# Altium schematic sheet PTFV_MECHANICAL.SchDoc: PTFV_MECHANICAL
size A4; DrawnBy: All; Revision: 1; SheetNumber: 4; SheetTotal: 4  of  5
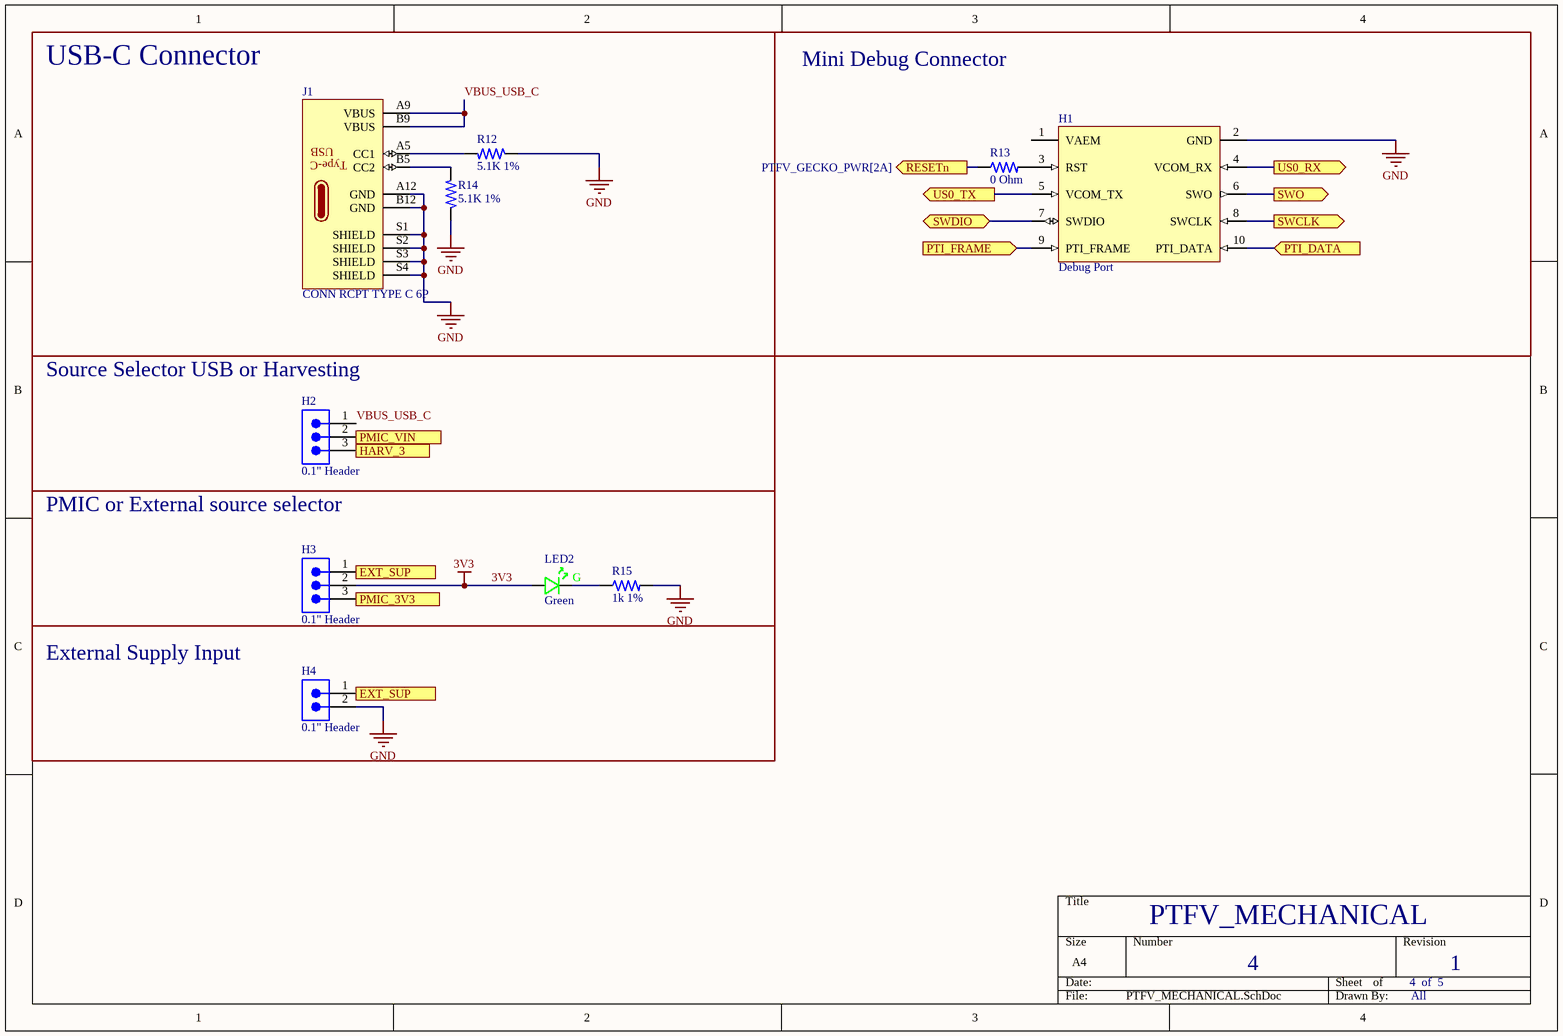
[diagram p0: PTFV_MECHANICAL.SchDoc]

## Parts
H1  Debug Port  [Amphenol_20021121_0]
H2  0.1" Header  [3-PIN_MALE_HEADER_01-IN]
H3  0.1" Header  [3-PIN_MALE_HEADER_01-IN]
H4  0.1" Header  [2-PIN_MALE_HEADER_01-IN]
J1  CONN RCPT TYPE C 6P  [USB4125-GF-A_REVA2]
LED2  Green  [LED_0603_GRN_WL-SMCW]
R12  5.1K 1%  [RES_0603_1608X06]
R13  0 Ohm  [RES_0603_1608X06]
R14  5.1K 1%  [RES_0603_1608X06]
R15  1k 1%  [RES_0603_1608X06]

## Blocks framed on the sheet
USB-C Connector: J1 R12 R14
Mini Debug Connector: H1 R13
Source Selector USB or Harvesting: H2
PMIC or External source selector: H3 LED2 R15
External Supply Input: H4

## Ports
EXT_SUP (in, see PTFV_MECHANICAL[1C]), EXT_SUP (out, see PTFV_MECHANICAL[1C]), HARV_3 (out, see PTFV_PWR_PMIC[1B]), PMIC_3V3 (in, see PTFV_PWR_PMIC[3B]), PMIC_VIN (out, see PTFV_PWR_PMIC[1B]), PTI_DATA (in, see PTFV_GECKO_SNSR[2A]), PTI_FRAME (in, see PTFV_GECKO_SNSR[2A]), RESETn (out, see PTFV_GECKO_PWR[2A]), SWCLK (out, see PTFV_GECKO_SNSR[2A]), SWDIO (bidir, see PTFV_GECKO_SNSR[2A]), SWO (out, see PTFV_GECKO_SNSR[2A]), US0_RX (out, see PTFV_GECKO_SNSR[2A]), US0_TX (out, see PTFV_GECKO_SNSR[2A])

## Nets
3V3: H3.2 LED2.A
GND: H1.2(GND) H4.2 J1.A12(GND) J1.B12(GND) J1.S1(SHIELD) J1.S2(SHIELD) J1.S3(SHIELD) J1.S4(SHIELD) R12.1 R14.1 R15.2
EXT_SUP: H3.1 H4.1 ; port EXT_SUP
HARV_3: H2.3 ; port HARV_3
PMIC_3V3: H3.3 ; port PMIC_3V3
PMIC_VIN: H2.2 ; port PMIC_VIN
PTI_DATA: H1.10(PTI_DATA) ; port PTI_DATA
PTI_FRAME: H1.9(PTI_FRAME) ; port PTI_FRAME
RESETn: R13.1 ; port RESETn
SWCLK: H1.8(SWCLK) ; port SWCLK
SWDIO: H1.7(SWDIO) ; port SWDIO
SWO: H1.6(SWO) ; port SWO
US0_RX: H1.4(VCOM_RX) ; port US0_RX
US0_TX: H1.5(VCOM_TX) ; port US0_TX
VBUS_USB_C: H2.1 J1.A9(VBUS) J1.B9(VBUS)
NetH1_3: H1.3(RST) R13.2
NetJ1_A5: J1.A5(CC1) R12.2
NetJ1_B5: J1.B5(CC2) R14.2
NetLED2_C: LED2.C R15.1

Not connected (* = marked no-connect by the designer): H1 1(VAEM)

## Notes on the sheet
- (in symbol 150060GS75000) G
- (in symbol USB_Type_C_6P_RA_TH) USB; Type-C

## Library data of the parts
H1 = 20021121-00010C1LF: CONN HEADER SMD 10POS 1.27MM. Connector Header Surface Mount 10 position 0.050"; Manufacturer: Amphenol ICC / FCI; Supplier 1: Digi-Key; Manufacturer Part Number: 20021121-00010C1LF; RoHS: No; Category: Headers and Wire Housings
H2 H3 = PRPC003SAAN-RC: CONN HEADER VERT 3POS 2.54MM; Manufacturer: Sullins; Connector Type: Header, Unshrouded, Breakaway; Number of Positions: 3; Number of Positions Loaded: All; Pitch: 0.100" (2.54mm); Online Catalog: 0.100" (2.54mm) Pitch Connector Headers; Other Names: S9510E-03  S9510E-03-ND; Supplier 1: Digi-Key; Manufacturer Part Number: PRPC003SAAN-RC; Stock 1: 19067; Pricing 1: 1=0.12, 10=0.109, 25=0.0812, 50=0.0696, 100=0.0673, 250=0.058, 500=0.0557 (USD); Standard Package: 1; Category: Connectors, Interconnects; Family: Rectangular Connectors - Headers, Male Pins; Series: -; Packaging: Bulk; Contact Type: Male Pin; Number of Rows: 1; Row Spacing: -; Contact Mating Length: 0.230" (5.84mm); Mounting Type: Through Hole; Termination: Solder; Fastening Type: -; Features: -; Contact Finish: Gold; Contact Finish Thickness: Flash; Color: Black; ComponentLink1URL: https://media.digikey.com/PDF/Data%20Sheets/Sullins%20PDFs/xRxCzzzSxxN-RC_ST_11635-B.pdf?src-supplier=Digi-Key; ComponentLink1Description: https://media.digikey.com/PDF/Data%20Sheets/Sullins%20PDFs/xRxCzzzSxxN-RC_ST_11635-B.pdf?src-supplier=Digi-Key; Supplier Part Number 1: S1011EC-03-ND
H4 = GRPB021VWVN-RC: Conn Unshrouded Header HDR 2 POS 2.54 MM Solder ST Top Entry Thru-Hole; Manufacturer: Sullins; Number of Positions: 2; Pitch: 1.27mm; Supplier: Digi-Key; Supplier Part Number: S9014E-02-ND; Manufacturer Part Number: GRPB021VWVN-RC; RoHS: Yes; Category: Headers and Wire Housings; Stock: 123797; Pricing: 1=0.25, 10=0.21, 100=0.1615, 500=0.13662, 1000=0.11178, 5000=0.09936, 10000=0.09005 (USD); Mounting Technology: Through Hole; Contact Material: Brass; Contact Shape: Square; Contact Finish - Mating: GOLD; Insulation Material: Nylon; Min Operating Temperature: -40°C; Max Operating Temperature: 105°C; Number of Rows: 1; Termination: Solder; Connector Type: Header; Contact Type: Male Pin; Fastening Type: Pull; Series: -; Packaging: Bulk; RoHS Compliant: Yes; Flammability Rating: UL94 V-0; Lead Free: Lead Free; ComponentLink1URL: https://datasheet.ciiva.com/726/71-grpb-1vwvn-rc-10957-c-726648.pdf?src-supplier=Digi-Key; ComponentLink1Description: https://datasheet.ciiva.com/726/71-grpb-1vwvn-rc-10957-c-726648.pdf?src-supplier=Digi-Key
J1 = USB_Type_C_6P_RA_TH: USB-C (USB TYPE-C) Receptacle Connector 24 (6+18 Dummy) Position Surface Mount, Right Angle; Through Hole; Manufacturer: GCT; Package: Cut-Tape; Manufacturer Part Number: USB4125-GF-A_REVA2; Price: None; Availability: Available; ComponentLink1Description: Digikey Link; ComponentLink1URL: https://www.digikey.com/en/products/detail/gct/USB4125-GF-A/13547388; Category: Connectors; Supplier: Digikey; Supplier Part Number 1: 2073-USB4125-GF-ACT-ND
LED2 = 150060GS75000: LED, 0603, GREEN, 430MCD, 520NM; Manufacturer: Wurth Electronics; Dynamic Catalog: 0603 Rectangle with Flat Top Chip LEDs; 3D Model: SMCW_0603.igs / SMCW_0603.stp / SMCW_0603.wrl; Wavelength - Peak: 515nm; Voltage - Forward (Vf) (Typ): 3.2V; Current - Test: 20mA; Viewing Angle: 140°; Lens Type: Clear; Lens Style/Size: Rectangle with Flat Top, 1.1mm x 0.7mm; Other Names: 732-4971-2; Supplier 1: Digi-Key; Manufacturer Part Number: 150060GS75000; Stock 1: 34964; Pricing 1: 1=0.14, 50=0.129, 100=0.11, 500=0.095 (USD); Standard Package: 4,000; Category: Optoelectronics; Family: LED Indication - Discrete; Series: WL-SMCW; Packaging: Tape & Reel (TR); Color: Green; Wavelength - Dominant: 520nm; Millicandela Rating: 430mcd; Package / Case: 0603 (1608 Metric); Size / Dimension: 1.60mm L x 0.80mm W; Height: 0.70mm; Mounting Type: Surface Mount; Online Catalog: 0603 Rectangle with Flat Top Chip LEDs; ComponentLink1URL: https://katalog.we-online.de/led/datasheet/150060GS75000.pdf?src-supplier=Digi-Key; ComponentLink1Description: https://katalog.we-online.de/led/datasheet/150060GS75000.pdf?src-supplier=Digi-Key; ComponentLink2URL: http://www.produktinfo.conrad.com/datenblaetter/750000-774999/759427-da-01-en-CHIPLED_0603_W_KL_GRUEN_150060GS75000.pdf?src-supplier=Conrad; ComponentLink2Description: http://www.produktinfo.conrad.com/datenblaetter/750000-774999/759427-da-01-en-CHIPLED_0603_W_KL_GRUEN_150060GS75000.pdf?src-supplier=Conrad; Supplier Part Number 1: 732-4971-1-ND
R12 R14 = RC0603FR-075K1L: RES SMD 5.1K OHM 1% 1/10W 0603; Manufacturer: Yageo; Additional Feature: LASER TRIMMABLE; Power: 100mW; Rated Temperature: 70°C; Value: 5.1kR; Temperature Coefficient: 100ppm/°C; Working Voltage: 75V; Package Height: 0.45mm; Package Length: 1.6mm; Package Width: 0.8mm; Supplier: Digi-Key; Supplier Part Number: 311-5.10KHRCT-ND; Manufacturer Part Number: RC0603FR-075K1L; RoHS: Yes; Category: Chip SMD Resistors; Stock: 2955457; Pricing: 1=0.1, 10=0.018, 50=0.0106, 100=0.0088, 500=0.00592, 1000=0.00505 (USD); Mounting Technology: Surface Mount; Pins: 2; Package Shape: Rectangular; Case/Package: 0603; Terminal Finish: Nickel; Min Operating Temperature: -55°C; Max Operating Temperature: 155°C; Tolerance: 1%; JESD-609 Code: e3; Resistor Type: FIXED RESISTOR; Construction: Chip; Package Style: SMTMeter; Packaging: Tape and Reel; Technology: METAL GLAZE/THICK FILM; Termination: Wraparound; Reach SVHC Compliant: Yes; RoHS Compliant: Yes; ComponentLink1URL: https://datasheet.ciiva.com:443/pdfs/VipMasterIC/IC/YAGO/YAGO-S-A0008145938/YAGO-S-A0008145938-1.pdf?src-supplier=IHS+Markit; ComponentLink1Description: https://datasheet.ciiva.com:443/pdfs/VipMasterIC/IC/YAGO/YAGO-S-A0008145938/YAGO-S-A0008145938-1.pdf?src-supplier=IHS+Markit; ComponentLink2URL: https://datasheet.ciiva.com/46395/443971-46395016.pdf?src-supplier=Element14; ComponentLink2Description: https://datasheet.ciiva.com/46395/443971-46395016.pdf?src-supplier=Element14; ComponentLink3URL: https://datasheet.ciiva.com/2454/pyu-r-int-thick-7-2454046.pdf?src-supplier=Digi-Key; ComponentLink3Description: https://datasheet.ciiva.com/2454/pyu-r-int-thick-7-2454046.pdf?src-supplier=Digi-Key; ComponentLink4URL: https://datasheet.ciiva.com/2454/pyu-r-int-thick-7-2454047.pdf?src-supplier=Digi-Key; ComponentLink4Description: https://datasheet.ciiva.com/2454/pyu-r-int-thick-7-2454047.pdf?src-supplier=Digi-Key; ComponentLink5URL: https://datasheet.ciiva.com/2454/pyu-r-int-thick-7-2454045.pdf?src-supplier=Digi-Key; ComponentLink5Description: https://datasheet.ciiva.com/2454/pyu-r-int-thick-7-2454045.pdf?src-supplier=Digi-Key; ComponentLink6URL: https://datasheet.ciiva.com/15189/getdatasheetpartid-326732-15189786.pdf?src-supplier=Verical; ComponentLink6Description: https://datasheet.ciiva.com/15189/getdatasheetpartid-326732-15189786.pdf?src-supplier=Verical
R13 = RMCF0603ZT0R00: RES SMD 0 OHM 1/10W 0603; Manufacturer: Stackpole Electronics; Value: 0R; Max Power Dissipation: 100mW; Voltage Rating: 75V; Supplier: Digi-Key; Supplier Part Number: RMCF0603ZT0R00CT-ND; Manufacturer Part Number: RMCF0603ZT0R00; RoHS: Yes; Category: Chip SMD Resistors; Stock: 12799112; Pricing: 1=0.1, 10=0.013, 25=0.0096, 50=0.0072, 100=0.0054, 250=0.00408, 500=0.00328, 1000=0.00241 (USD); Mounting Technology: Surface Mount; Case/Package: 0603; Case Code (Metric): 1608; Case Code (Imperial): 0603; Contact Plating: Tin,Matte; Min Operating Temperature: -55°C; Max Operating Temperature: 155°C; Packaging: Tape and Reel; Series: RMCF; Number of Terminations: 2; Features: Automotive AEC-Q200; Construction: Rectangular; Length: 1.55mm; Width: 0.031inch; Height: 0.022inch; Depth: 0.8mm; Radiation Hardening: No; Military Standard: Not; RoHS Compliant: Yes; ComponentLink1URL: https://datasheet.octopart.com/RMCF0603ZT0R00-Stackpole-Electronics-datasheet-11547379.pdf?src-supplier=Future+Electronics; ComponentLink1Description: https://datasheet.octopart.com/RMCF0603ZT0R00-Stackpole-Electronics-datasheet-11547379.pdf?src-supplier=Future+Electronics; ComponentLink2URL: https://www.seielect.com/catalog/SEI-Packaging.pdf?src-supplier=Avnet; ComponentLink2Description: https://www.seielect.com/catalog/SEI-Packaging.pdf?src-supplier=Avnet; ComponentLink3URL: https://www.seielect.com/catalog/SEI-Packaging.pdf?src-supplier=Arrow+Electronics; ComponentLink3Description: https://www.seielect.com/catalog/SEI-Packaging.pdf?src-supplier=Arrow+Electronics; ComponentLink4URL: https://www.seielect.com/catalog/SEI-Packaging.pdf?src-supplier=Verical; ComponentLink4Description: https://www.seielect.com/catalog/SEI-Packaging.pdf?src-supplier=Verical; ComponentLink5URL: https://www.seielect.com/Catalog/SEI-RMCF_RMCP.pdf?src-supplier=Digi-Key; ComponentLink5Description: https://www.seielect.com/Catalog/SEI-RMCF_RMCP.pdf?src-supplier=Digi-Key; ComponentLink6URL: https://www.seielect.com/catalog/SEI-Packaging.pdf?src-supplier=Digi-Key; ComponentLink6Description: https://www.seielect.com/catalog/SEI-Packaging.pdf?src-supplier=Digi-Key; ComponentLink7URL: https://datasheet.octopart.com/RMCF0603ZT0R00-Stackpole-Electronics-datasheet-154799224.pdf?src-supplier=Master+Electronics; ComponentLink7Description: https://datasheet.octopart.com/RMCF0603ZT0R00-Stackpole-Electronics-datasheet-154799224.pdf?src-supplier=Master+Electronics
R15 = RC0603FR-071KL: RES SMD 1k OHM 1% 1/10W 0603; Manufacturer: Yageo; Power Rating: 100mW; Value: 1kR; Voltage Rating: 50V; Temperature Coefficient: 100ppm/°C; Supplier: Digi-Key; Supplier Part Number: 311-1.00KHRCT-ND; Manufacturer Part Number: RC0603FR-071KL; RoHS: Yes; Category: Chip SMD Resistors; Stock: 18911788; Pricing: 1=0.1, 10=0.018, 50=0.0106, 100=0.0088, 500=0.00592, 1000=0.00505 (USD); Case/Package: 0603; Case Code (Imperial): 0603; Case Code (Metric): 1608; Contact Plating: Tin,Matte; Min Operating Temperature: -55°C; Max Operating Temperature: 155°C; Tolerance: 1%; Packaging: Tape and Reel; Termination: SMD/SMT; Resistor Type: Thick Film; Features: Moisture Resistant; Series: RC; Max Power Dissipation: 100mW; Number of Terminations: 2; Resistance Tolerance: 1%; Construction: Rectangular; Technology: THICK FILM; Length: 1.6mm; Height: 0.45mm; Depth: 0.8mm; Reach SVHC Compliant: No; Military Standard: Not; RoHS Compliant: Yes; Lead Free: 5697LeadFree